# EAGLE design RTI-Dome-eth-RP2040 (EAGLE 9.6.2)

## Sheet 1 of 2
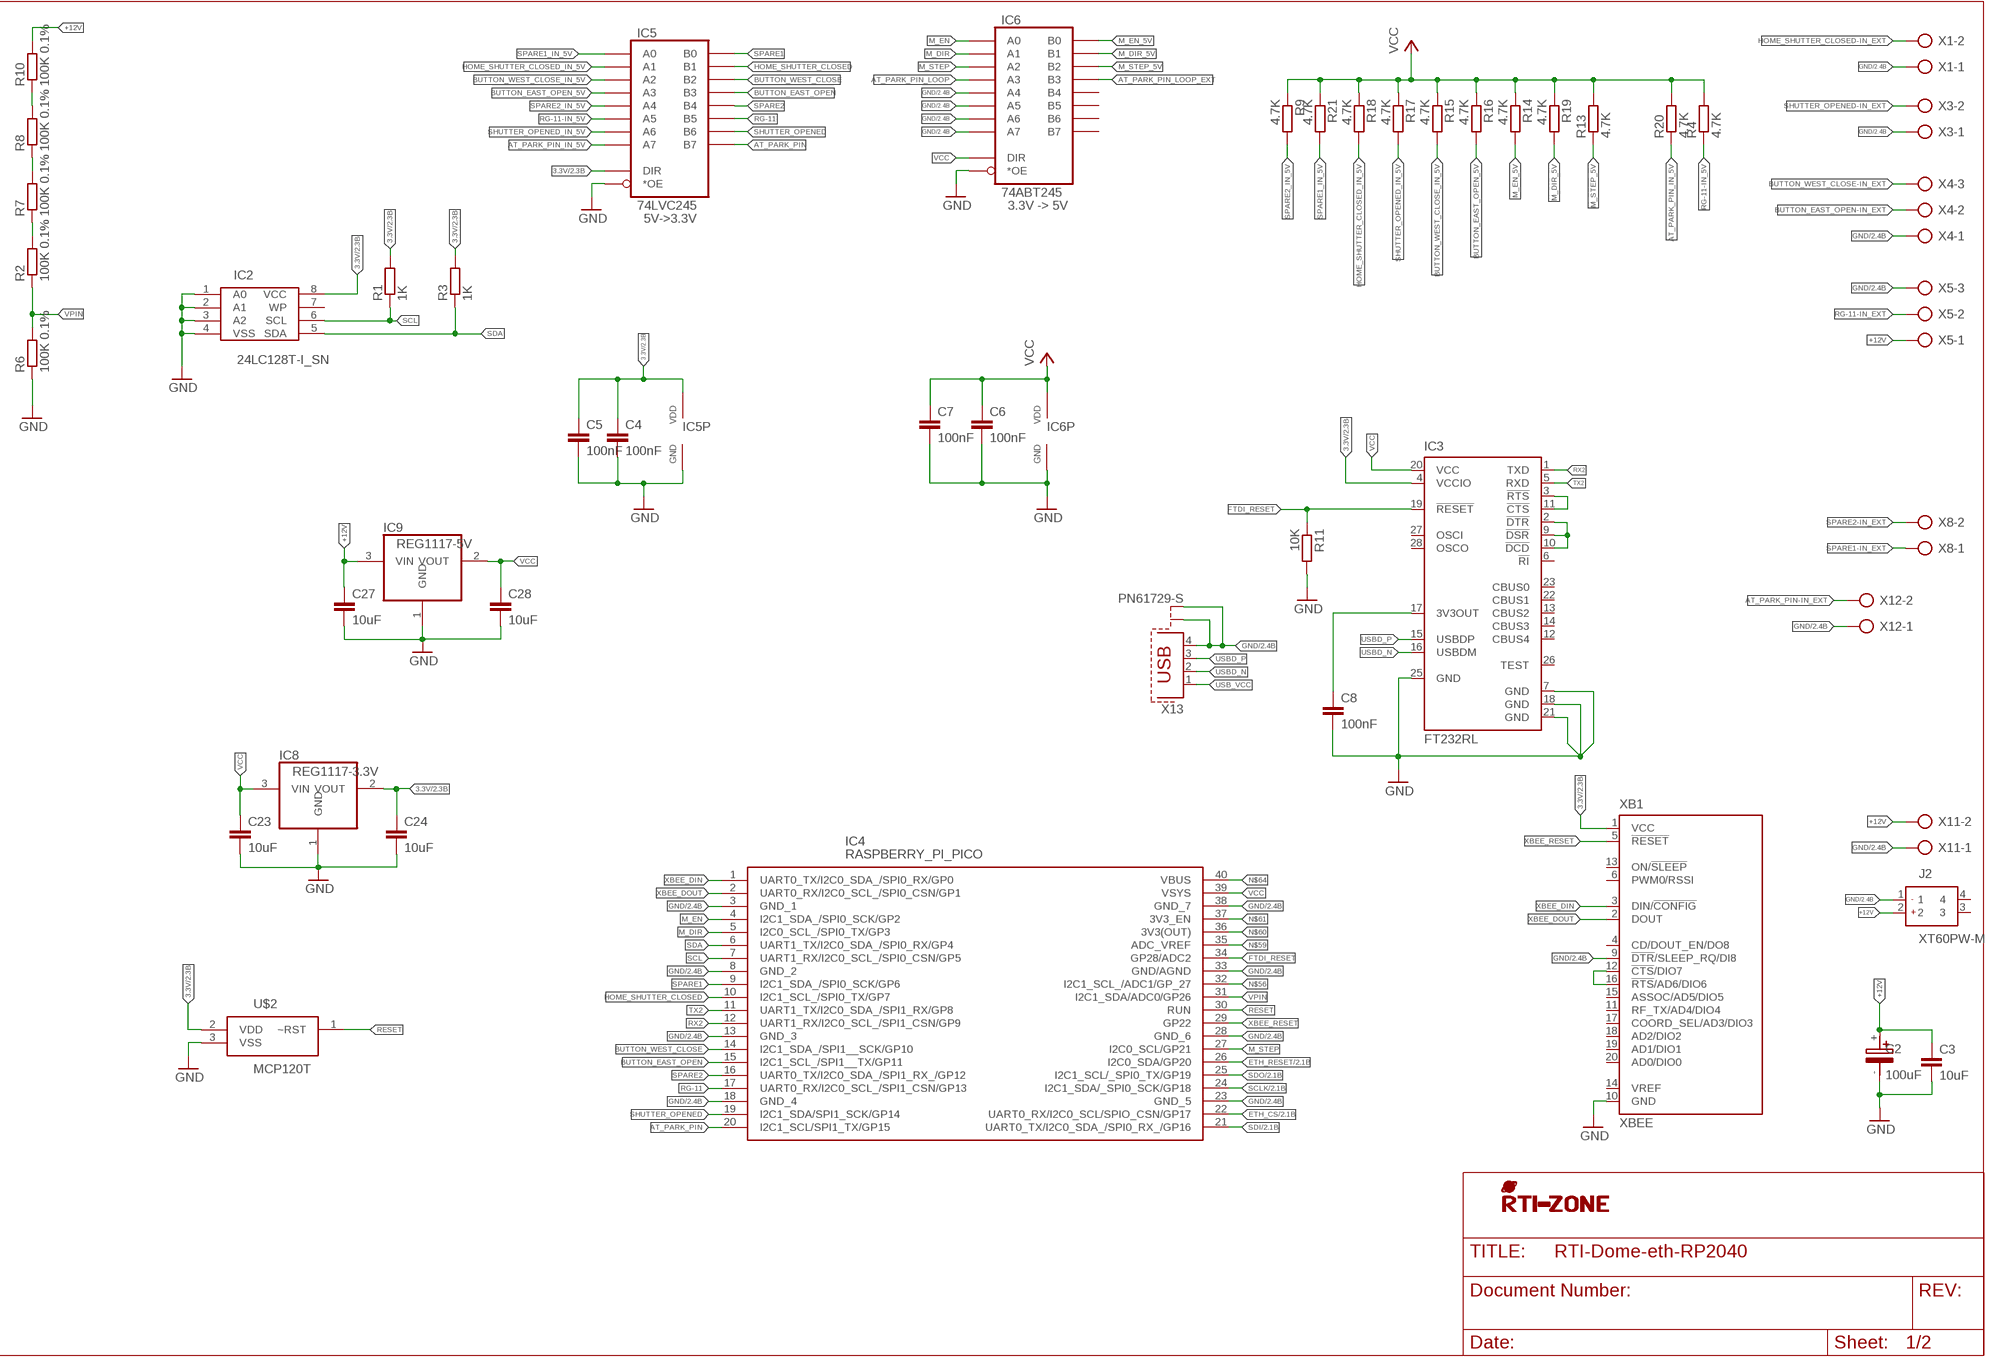
[diagram p0: schematic, sheet 1, part 1 of 2]
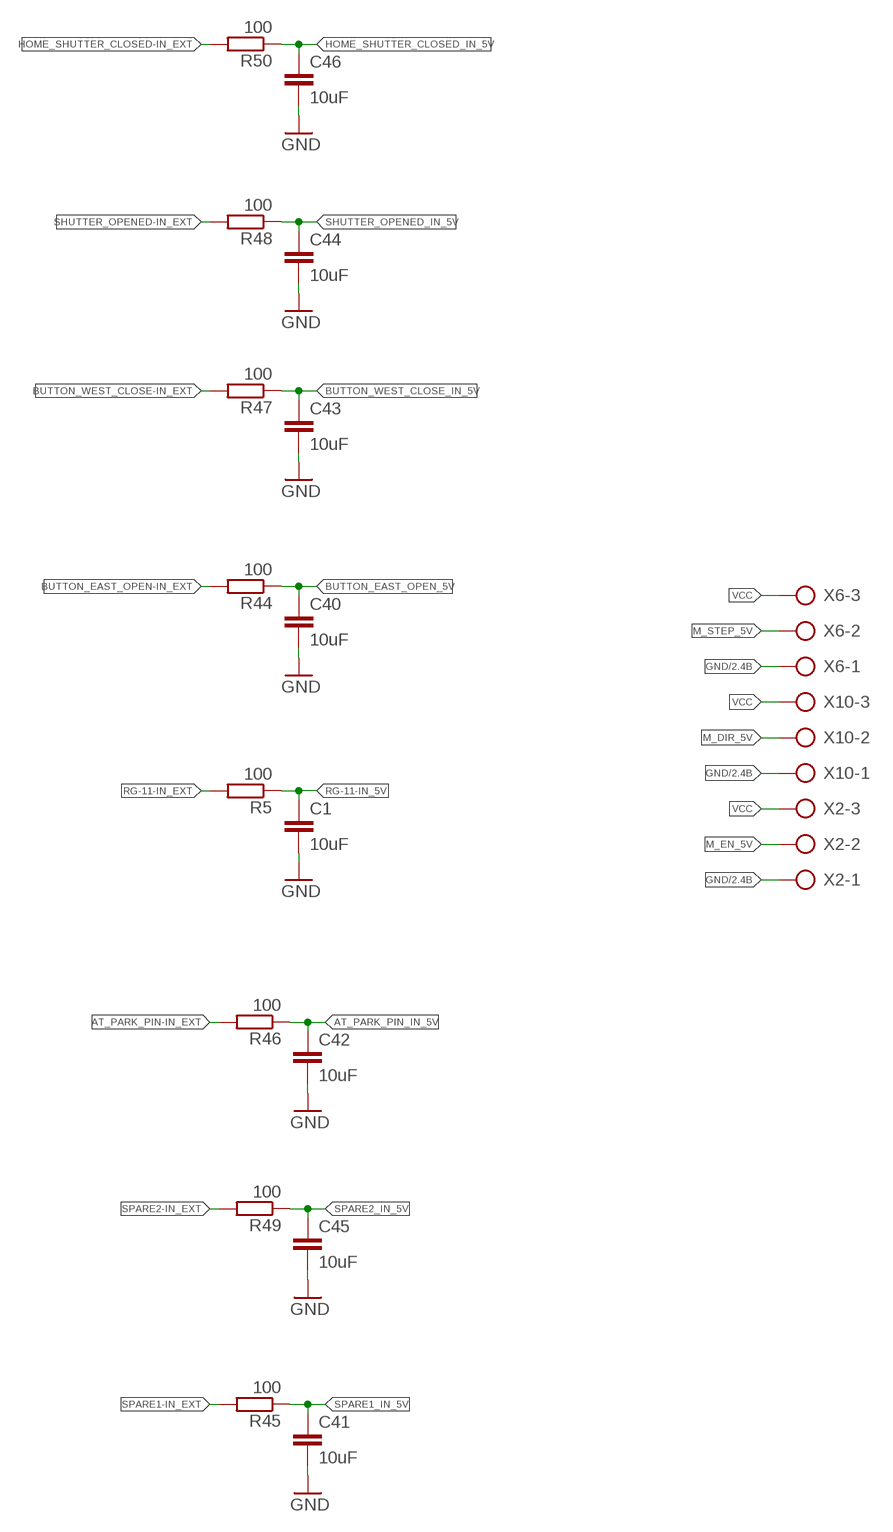
[diagram p1: schematic, sheet 1, part 2 of 2]

### Parts
C1  10uF  C-EUC0805  [C0805]
C2  100uF  MAL215099804E3""  [UD-10X10_NICHICON]
C3  10uF  C-EUC0805  [C0805]
C4  100nF  C-EUC0805  [C0805]
C5  100nF  C-EUC0805  [C0805]
C6  100nF  C-EUC0805  [C0805]
C7  100nF  C-EUC0805  [C0805]
C8  100nF  C-EUC0805  [C0805]
C23  10uF  C-EUC0805  [C0805]
C24  10uF  C-EUC0805  [C0805]
C27  10uF  C-EUC0805  [C0805]
C28  10uF  C-EUC0805  [C0805]
C40  10uF  C-EUC0805  [C0805]
C41  10uF  C-EUC0805  [C0805]
C42  10uF  C-EUC0805  [C0805]
C43  10uF  C-EUC0805  [C0805]
C44  10uF  C-EUC0805  [C0805]
C45  10uF  C-EUC0805  [C0805]
C46  10uF  C-EUC0805  [C0805]
IC2  24LC128T-I_SN  [SOIC127P600X175-8N]
IC3  FT232RL  [SSOP28]
IC4  RASPBERRY_PI_PICO  [RASPBERRYPIPICO]
IC5  74LVC245  [TSSOP20]
IC6  74ABT245  [TSSOP20]
IC8  REG1117-3.3V  REG1117  [SOT223]
IC9  REG1117-5V  REG1117  [SOT223]
J2  XT60PW-M  [XT60PWM]
R1  1K  R-EU_R0805  [R0805]
R2  100K 0.1%  R-EU_R0805  [R0805]
R3  1K  R-EU_R0805  [R0805]
R4  4.7K  R-EU_R0805  [R0805]
R5  100  R-EU_R0805  [R0805]
R6  100K 0.1%  R-EU_R0805  [R0805]
R7  100K 0.1%  R-EU_R0805  [R0805]
R8  100K 0.1%  R-EU_R0805  [R0805]
R9  4.7K  R-EU_R0805  [R0805]
R10  100K 0.1%  R-EU_R0805  [R0805]
R11  10K  R-EU_R0805  [R0805]
R13  4.7K  R-EU_R0805  [R0805]
R14  4.7K  R-EU_R0805  [R0805]
R15  4.7K  R-EU_R0805  [R0805]
R16  4.7K  R-EU_R0805  [R0805]
R17  4.7K  R-EU_R0805  [R0805]
R18  4.7K  R-EU_R0805  [R0805]
R19  4.7K  R-EU_R0805  [R0805]
R20  4.7K  R-EU_R0805  [R0805]
R21  4.7K  R-EU_R0805  [R0805]
R44  100  R-EU_R0805  [R0805]
R45  100  R-EU_R0805  [R0805]
R46  100  R-EU_R0805  [R0805]
R47  100  R-EU_R0805  [R0805]
R48  100  R-EU_R0805  [R0805]
R49  100  R-EU_R0805  [R0805]
R50  100  R-EU_R0805  [R0805]
U$2  MCP120T  [SOT95P237X112-3N]
U$4  RTI-LOGO_BIG  [LOGO_BIG]
X1  AK500/2  [AK500/2]
X2  AK500/3  [AK500/3]
X3  AK500/2  [AK500/2]
X4  AK500/3  [AK500/3]
X5  AK500/3  [AK500/3]
X6  AK500/3  [AK500/3]
X8  AK500/2  [AK500/2]
X10  AK500/3  [AK500/3]
X11  AK500/2  [AK500/2]
X12  AK500/2  [AK500/2]
X13  PN61729-S  [PN61729-S]
XB1  XBEE  [XBEE]

### Nets
3.3V: C4.1 C5.1 C24.1 IC2.8(VCC) IC3.4(VCCIO) IC5.P$1(DIR) IC5.P$20(VDD) IC8.2(VOUT) R1.2 R3.2 U$2.2(VDD) XB1.1(VCC) ; also sheet 2
+12V [+12V]: C2.+ C3.1 C27.1 IC9.3(VIN) J2.2 R10.2 X5.1 X11.2
AT_PARK_PIN: IC4.20(I2C1_SCL/SPI1_TX/GP15) IC5.P$11(B7)
AT_PARK_PIN-IN_EXT: R46.2 X12.2
AT_PARK_PIN_IN_5V: C42.1 IC5.P$9(A7) R20.1 R46.1
AT_PARK_PIN_LOOP: IC6.P$5(A3)
AT_PARK_PIN_LOOP_EXT: IC6.P$15(B3)
BUTTON_EAST_OPEN: IC4.15(I2C1_SCL_/SPI1__TX/GP11) IC5.P$15(B3)
BUTTON_EAST_OPEN-IN_EXT: R44.2 X4.2
BUTTON_EAST_OPEN_5V: C40.1 IC5.P$5(A3) R16.2 R44.1
BUTTON_WEST_CLOSE: IC4.14(I2C1_SDA_/SPI1__SCK/GP10) IC5.P$16(B2)
BUTTON_WEST_CLOSE-IN_EXT: R47.2 X4.3
BUTTON_WEST_CLOSE_IN_5V: C43.1 IC5.P$4(A2) R15.2 R47.1
DTR_DSR_DCD: IC3.2(!DTR) IC3.9(!DSR) IC3.10(!DCD)
ETH_CS: IC4.22(UART0_RX/I2C0_SCL/SPIO_CSN/GP17) ; also sheet 2
ETH_RESET: IC4.26(I2C0_SDA/GP20) ; also sheet 2
FTDI_RESET: IC3.19(!RESET) IC4.34(GP28/ADC2) R11.1
GND [GND]: C1.2 C2.- C3.2 C4.2 C5.2 C6.2 C7.2 C8.2 C23.2 C24.2 C27.2 C28.2 C40.2 C41.2 C42.2 C43.2 C44.2 C45.2 C46.2 IC2.1(A0) IC2.2(A1) IC2.3(A2) IC2.4(VSS) IC3.7(GND) IC3.18(GND) IC3.21(GND) IC3.25(GND) IC4.3(GND_1) IC4.8(GND_2) IC4.13(GND_3) IC4.18(GND_4) IC4.23(GND_5) IC4.28(GND_6) IC4.33(GND/AGND) IC4.38(GND_7) IC5.P$10(GND) IC5.P$19(*OE) IC6.P$6(A4) IC6.P$7(A5) IC6.P$8(A6) IC6.P$9(A7) IC6.P$10(GND) IC6.P$19(*OE) IC8.1(GND) IC9.1(GND) J2.1 R6.1 R11.2 U$2.3(VSS) X1.1 X2.1 X3.1 X4.1 X5.3 X6.1 X10.1 X11.1 X12.1 X13.4 X13.S1 X13.S2 XB1.9(!DTR!/SLEEP_RQ/DI8) XB1.10(GND) ; also sheet 2
HOME_SHUTTER_CLOSED: IC4.10(I2C1_SCL_/SPI0_TX/GP7) IC5.P$17(B1)
HOME_SHUTTER_CLOSED-IN_EXT: R50.2 X1.2
HOME_SHUTTER_CLOSED_IN_5V: C46.1 IC5.P$3(A1) R18.2 R50.1
M_DIR: IC4.5(I2C0_SCL_/SPI0_TX/GP3) IC6.P$3(A1)
M_DIR_5V: IC6.P$17(B1) R19.2 X10.2
M_EN: IC4.4(I2C1_SDA_/SPI0_SCK/GP2) IC6.P$2(A0)
M_EN_5V: IC6.P$18(B0) R14.2 X2.2
M_STEP: IC4.27(I2C0_SCL/GP21) IC6.P$4(A2)
M_STEP_5V: IC6.P$16(B2) R13.1 X6.2
N$2: R7.2 R8.1
N$3: R8.2 R10.1
N$5: R2.2 R7.1
N$6: C8.1 IC3.17(3V3OUT)
N$9: XB1.12(!CTS!/DIO7) XB1.16(!RTS!/AD6/DIO6)
N$56: IC4.32(I2C1_SCL_/ADC1/GP_27)
N$59: IC4.35(ADC_VREF)
N$60: IC4.36(3V3(OUT))
N$61: IC4.37(3V3_EN)
N$64: IC4.40(VBUS)
RESET: IC4.30(RUN) U$2.1(~RST)
RG-11: IC4.17(UART0_RX/I2C0_SCL_/SPI1_CSN/GP13) IC5.P$13(B5)
RG-11-IN_5V: C1.1 IC5.P$7(A5) R4.1 R5.1
RG-11-IN_EXT: R5.2 X5.2
RTS_CTS: IC3.3(!RTS) IC3.11(!CTS)
RX2: IC3.1(TXD) IC4.12(UART1_RX/I2C0_SCL_/SPI1_CSN/GP9)
SCL: IC2.6(SCL) IC4.7(UART1_RX/I2C0_SCL_/SPI0_CSN/GP5) R1.1
SCLK: IC4.24(I2C1_SDA/_SPI0_SCK/GP18) ; also sheet 2
SDA: IC2.5(SDA) IC4.6(UART1_TX/I2C0_SDA_/SPI0_RX/GP4) R3.1
SDI: IC4.21(UART0_TX/I2C0_SDA_/SPI0_RX_/GP16) ; also sheet 2
SDO: IC4.25(I2C1_SCL/_SPI0_TX/GP19) ; also sheet 2
SHUTTER_OPENED: IC4.19(I2C1_SDA/SPI1_SCK/GP14) IC5.P$12(B6)
SHUTTER_OPENED-IN_EXT: R48.2 X3.2
SHUTTER_OPENED_IN_5V: C44.1 IC5.P$8(A6) R17.2 R48.1
SPARE1: IC4.9(I2C1_SDA_/SPI0_SCK/GP6) IC5.P$18(B0)
SPARE1-IN_EXT: R45.2 X8.1
SPARE1_IN_5V: C41.1 IC5.P$2(A0) R21.2 R45.1
SPARE2: IC4.16(UART0_TX/I2C0_SDA_/SPI1_RX_/GP12) IC5.P$14(B4)
SPARE2-IN_EXT [GND]: R49.2 X8.2
SPARE2_IN_5V [GND]: C45.1 IC5.P$6(A4) R9.2 R49.1
TX2: IC3.5(RXD) IC4.11(UART1_TX/I2C0_SDA_/SPI1_RX/GP8)
USB_VCC: X13.1
USBD_N: IC3.16(USBDM) X13.2
USBD_P: IC3.15(USBDP) X13.3
VCC: C6.1 C7.1 C23.1 C28.1 IC3.20(VCC) IC4.39(VSYS) IC6.P$1(DIR) IC6.P$20(VDD) IC8.3(VIN) IC9.2(VOUT) R4.2 R9.1 R13.2 R14.1 R15.1 R16.1 R17.1 R18.1 R19.1 R20.2 R21.1 X2.3 X6.3 X10.3
VPIN: IC4.31(I2C1_SDA/ADC0/GP26) R2.1 R6.2
XBEE_DIN: IC4.1(UART0_TX/I2C0_SDA_/SPI0_RX/GP0) XB1.3(DIN/!CONFIG)
XBEE_DOUT: IC4.2(UART0_RX/I2C0_SCL_/SPI0_CSN/GP1) XB1.2(DOUT)
XBEE_RESET: IC4.29(GP22) XB1.5(!RESET)
Unconnected: IC2.7(WP) IC3.6(!RI) IC3.12(CBUS4) IC3.13(CBUS2) IC3.14(CBUS3) IC3.22(CBUS1) IC3.23(CBUS0) IC3.26(TEST) IC3.27(OSCI) IC3.28(OSCO) IC6.P$11(B7) IC6.P$12(B6) IC6.P$13(B5) IC6.P$14(B4) J2.3 J2.4 XB1.4(CD/DOUT_EN/DO8) XB1.6(PWM0/RSSI) XB1.11(RF_TX/AD4/DIO4) XB1.13(ON/!SLEEP) XB1.14(VREF) XB1.15(ASSOC/AD5/DIO5) XB1.17(COORD_SEL/AD3/DIO3) XB1.18(AD2/DIO2) XB1.19(AD1/DIO1) XB1.20(AD0/DIO0)

### Notes on the sheet
- 3.3V -> 5V
- 5V->3.3V

## Sheet 2 of 2
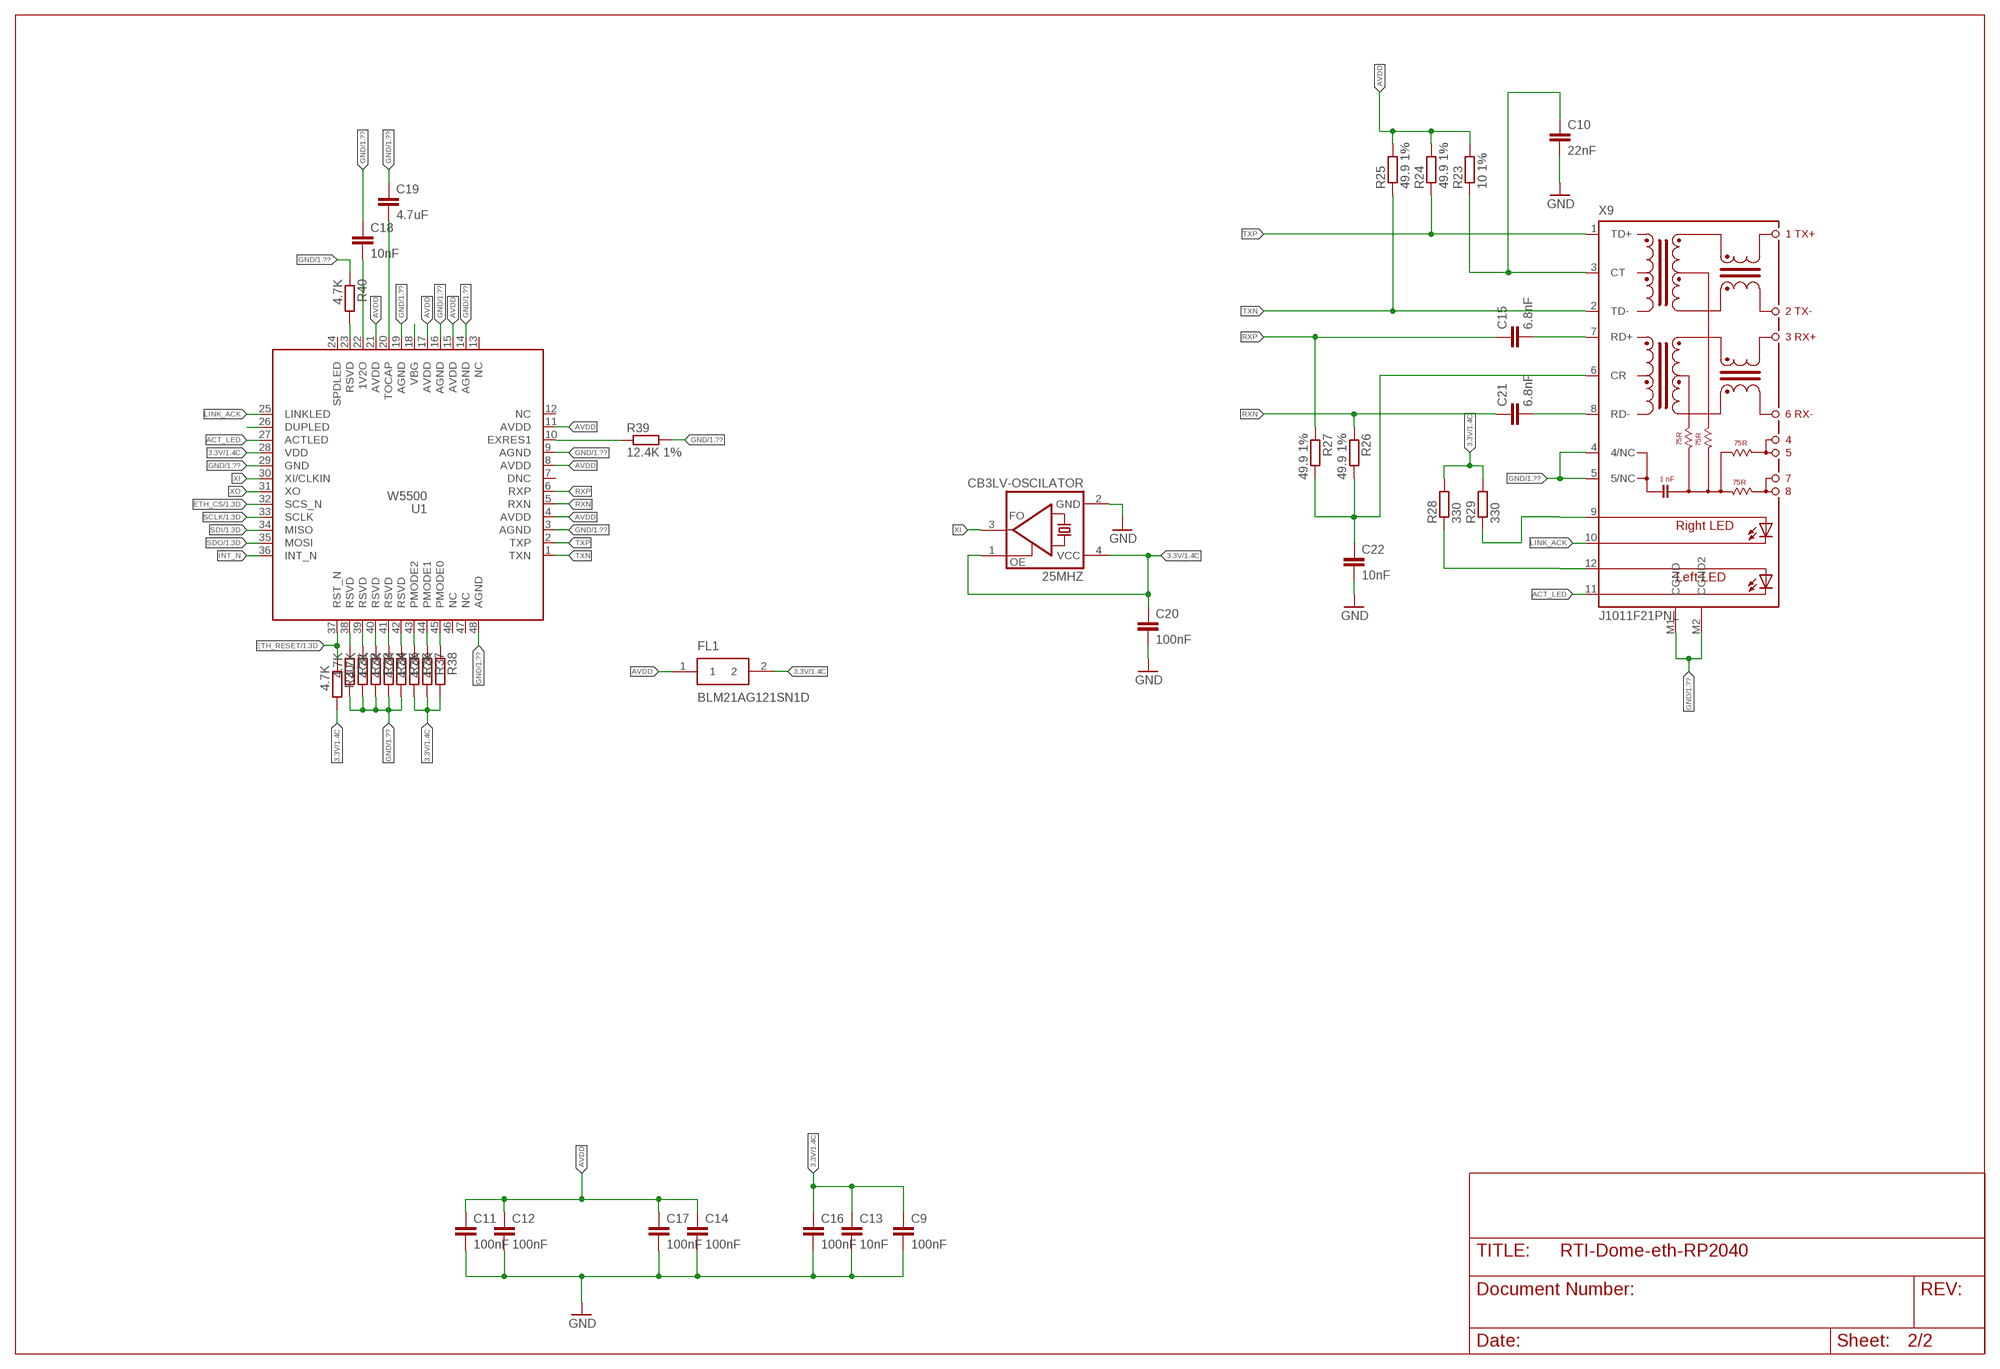
[diagram p2: schematic, sheet 2]

### Parts
25MHZ  CB3LV-OSCILATOR  [SMD-7050_4P]
C9  100nF  C-EUC0805  [C0805]
C10  22nF  C-EUC0805  [C0805]
C11  100nF  C-EUC0805  [C0805]
C12  100nF  C-EUC0805  [C0805]
C13  10nF  C-EUC0805  [C0805]
C14  100nF  C-EUC0805  [C0805]
C15  6.8nF  C-EUC0805  [C0805]
C16  100nF  C-EUC0805  [C0805]
C17  100nF  C-EUC0805  [C0805]
C18  10nF  C-EUC0805  [C0805]
C19  4.7uF  C-EUC0805  [C0805]
C20  100nF  C-EUC0805  [C0805]
C21  6.8nF  C-EUC0805  [C0805]
C22  10nF  C-EUC0805  [C0805]
FL1  BLM21AG121SN1D  [L0805]
R23  10 1%  R-EU_R0805  [R0805]
R24  49.9 1%  R-EU_R0805  [R0805]
R25  49.9 1%  R-EU_R0805  [R0805]
R26  49.9 1%  R-EU_R0805  [R0805]
R27  49.9 1%  R-EU_R0805  [R0805]
R28  330  R-EU_R0805  [R0805]
R29  330  R-EU_R0805  [R0805]
R30  4.7K  R-EU_R0805  [R0805]
R31  4.7K  R-EU_R0805  [R0805]
R32  4.7K  R-EU_R0805  [R0805]
R33  4.7K  R-EU_R0805  [R0805]
R34  4.7K  R-EU_R0805  [R0805]
R35  4.7K  R-EU_R0805  [R0805]
R36  4.7K  R-EU_R0805  [R0805]
R37  4.7K  R-EU_R0805  [R0805]
R38  4.7K  R-EU_R0805  [R0805]
R39  12.4K 1%  R-EU_R0805  [R0805]
R40  4.7K  R-EU_R0805  [R0805]
U1  W5500  [LQFP48]
X9  J1011F21PNL  [J1011F21PNL]

### Nets
3.3V: 25MHZ.1(OE) 25MHZ.4(VDD) C9.1 C13.1 C16.1 C20.1 FL1.2 R28.2 R29.2 R30.2 R36.2 R37.2 R38.2 U1.28(VDD) ; also sheet 1
ACT_LED: U1.27(ACTLED) X9.11(C-L)
AVDD: C11.1 C12.1 C14.1 C17.1 FL1.1 R23.2 R24.2 R25.2 U1.4(AVDD) U1.8(AVDD) U1.11(AVDD) U1.15(AVDD) U1.17(AVDD) U1.21(AVDD)
ETH_CS: U1.32(SCS_N) ; also sheet 1
ETH_RESET: R30.1 U1.37(RST_N) ; also sheet 1
GND [GND]: 25MHZ.2(GND) C9.2 C10.2 C11.2 C12.2 C13.2 C14.2 C16.2 C17.2 C18.1 C19.1 C20.2 C22.2 R31.2 R32.2 R33.2 R34.2 R35.2 R39.2 R40.1 U1.3(AGND) U1.9(AGND) U1.14(AGND) U1.16(AGND) U1.19(AGND) U1.29(GND) U1.48(AGND) X9.4(4/NC) X9.5(5/NC) X9.M1(CGND) X9.M2(CGND2) ; also sheet 1
INT_N: U1.36(INT_N)
LINK_ACK: U1.25(LINKLED) X9.10(C-R)
N$7 [+3V3]: C22.1 R26.2 R27.2 X9.6(CR)
N$8: R29.1 X9.9(A-R)
N$10: R28.1 X9.12(AL)
N$11: C15.2 X9.7(RD+)
N$12: C21.2 X9.8(RD-)
N$13 [+3V3]: C10.1 R23.1 X9.3(CT)
N$17: U1.26(DUPLED)
N$22: R31.1 U1.38(RSVD)
N$23: R32.1 U1.39(RSVD)
N$24: R33.1 U1.40(RSVD)
N$25: R34.1 U1.41(RSVD)
N$26: R35.1 U1.42(RSVD)
N$27: R36.1 U1.43(PMODE2)
N$28: R37.1 U1.44(PMODE1)
N$29: R38.1 U1.45(PMODE0)
N$31: C19.2 U1.20(TOCAP)
N$32: U1.18(VBG)
N$33: C18.2 U1.22(1V2O)
N$34: R39.1 U1.10(EXRES1)
N$35: R40.2 U1.23(RSVD)
RXN: C21.1 R26.1 U1.5(RXN)
RXP: C15.1 R27.1 U1.6(RXP)
SCLK: U1.33(SCLK) ; also sheet 1
SDI: U1.34(MISO) ; also sheet 1
SDO: U1.35(MOSI) ; also sheet 1
TXN [diff]: R25.1 U1.1(TXN) X9.2(TD-)
TXP: R24.1 U1.2(TXP) X9.1(TD+)
XI: 25MHZ.3(FO) U1.30(XI/CLKIN)
XO: U1.31(XO)
Unconnected: U1.7(DNC) U1.12(NC) U1.13(NC) U1.24(SPDLED) U1.46(NC) U1.47(NC)

## Library data of the parts
25MHZ = rti:CB3LV-OSCILATOR; MPN: CB3LV-3I-25M0000
C1 C3 C23 C24 C27 C28 C40-C46 = rcl:C-EU: CAPACITOR, European symbol; MPN: CC0805KKX5R8BB106; SPICEPREFIX: C
C2 = samacsys:MAL215099804E3: Aluminum Electrolytic Capacitors - SMD 100uF 63V 20% Source: Datasheet <https://www.vishay.com/docs/28395/150crz.pdf>; MPN: MAL215099804E3
C4-C9 C11 C12 C14 C16 C17 C20 = rcl:C-EU: CAPACITOR, European symbol; MPN: 0805YD104KAT2A; SPICEPREFIX: C
C10 = rcl:C-EU: CAPACITOR, European symbol; MPN: CC0805JRX7R8BB223; SPICEPREFIX: C
C13 C18 C22 = rcl:C-EU: CAPACITOR, European symbol; MPN: CC0805KRX7R9BB103; SPICEPREFIX: C
C15 C21 = rcl:C-EU: CAPACITOR, European symbol; MPN: C0805C682F4HACTU; SPICEPREFIX: C
C19 = rcl:C-EU: CAPACITOR, European symbol; MPN: C0805C475J3RACTU; SPICEPREFIX: C
FL1 = BLM21AG121SN1D:BLM21AG121SN1D: BLM21_N1D Series EMI Suppression Filter 120+/-25% at 100MHz 1A @85 Source: Datasheet <https://www.murata.com/en-us/products/productdetail?partno=BLM21AG121SN1#>; MPN: BLM21AG121SN1D
IC2 = rti:24LC128T-I_SN: 128K I2C CMOS Serial EEPROM Source: Datasheet <http://componentsearchengine.com/Datasheets/3/24LC128T-I_SN.pdf>; ARROW_PART_NUMBER: 24LC128T-I/SN; ARROW_PRICE-STOCK: https://www.arrow.com/en/products/24lc128t-isn/microchip-technology?region=nac; DESCRIPTION: 128K I2C CMOS Serial EEPROM; HEIGHT: 1.75mm; MANUFACTURER_NAME: Microchip; MANUFACTURER_PART_NUMBER: 24LC128T-I/SN; MOUSER_PART_NUMBER: 579-24LC128T-I/SN; MOUSER_PRICE-STOCK: https://www.mouser.co.uk/ProductDetail/Microchip-Technology-Atmel/24LC128T-I-SN?qs=gySgac5WNsG75YWNtruaXg%3D%3D
IC3 = ftdichip:FT232R: Source: http://www.ftdichip.com/Documents/DataSheets/DS_FT232R_v104.pdf; MPN: FT232RL-REEL; OC_FARNELL: 1146032; OC_NEWARK: 91K9918
IC4 = samacsys:RASPBERRY_PI_PICO: RASPBERRY-PI - RASPBERRY PI PICO W - Raspberry Pi Board, Raspberry Pi Pico W, RP2040, 32bit, ARM Cortex-M0+ Source: Datasheet <https://datasheets.raspberrypi.com/picow/pico-w-datasheet.pdf>; DESCRIPTION: RASPBERRY-PI - RASPBERRY PI PICO - Raspberry Pi Board, Raspberry Pi Pic, RP2040, 32bit, ARM Cortex-M0+; HEIGHT: 1mm; MANUFACTURER_NAME: RASPBERRY-PI PICO; MANUFACTURER_PART_NUMBER: SC0916; MOUSER_PART_NUMBER: SC0915; MPN: SC0916
IC5 = rti:74*245; MPN: SN74LVC245APWR
IC6 = rti:74*245; MPN: 74ABT245PW,118
IC8 IC9 = burr-brown:REG1117: 800mA and 1A Low Dropout (LDO) Positive Regulator 1.8V, 2.5V, 2.85V, 3.3V, 5V, and Adj; MPN: REG1117-3.3/2K5; OC_FARNELL: 1097566; OC_NEWARK: 14P6981
J2 = samacsys:XT60PW-M: Socket; DC supply; XT60; male; PIN: 2; on PCBs; THT; Colour: yellow Source: Datasheet <https://www.tme.eu/Document/9b8d0c5eb7094295f3d3112c214d3ade/XT60PW SPEC.pdf>; DESCRIPTION: Socket; DC supply; XT60; male; PIN: 2; on PCBs; THT; Colour: yellow; HEIGHT: 8.4mm; MANUFACTURER_NAME: Changzou Amass Elec; MANUFACTURER_PART_NUMBER: XT60PW-M
R1 R3 = rcl:R-EU_: RESISTOR, European symbol; MPN: RT0805FRE071KL; SPICEPREFIX: R
R2 R6-R8 R10 = rcl:R-EU_: RESISTOR, European symbol; MPN: AT0805BRD07100KL; SPICEPREFIX: R
R4 R9 R13-R21 R30-R38 R40 = rcl:R-EU_: RESISTOR, European symbol; MPN: RT0805FRE074K7L; SPICEPREFIX: R
R5 R44-R50 = rcl:R-EU_: RESISTOR, European symbol; MPN: RT0805FRD07100RL; SPICEPREFIX: R
R11 = rcl:R-EU_: RESISTOR, European symbol; MPN: RT0805FRE0710KL; SPICEPREFIX: R
R23 = rcl:R-EU_: RESISTOR, European symbol; MPN: RT0805FRE1310RL; SPICEPREFIX: R
R24-R27 = rcl:R-EU_: RESISTOR, European symbol; MPN: RC0805FR-0749R9L; SPICEPREFIX: R
R28 R29 = rcl:R-EU_: RESISTOR, European symbol; MPN: RC0805JR-07330RL; SPICEPREFIX: R
R39 = rcl:R-EU_: RESISTOR, European symbol; MPN: RC0805FR-0712K4L; SPICEPREFIX: R
U1 = W5500:W5500; MPN: W5500
U$2 = MCP120T:MCP120T: Microcontroller Supervisory Circuit Source: Datasheet; DESCRIPTION: Microcontroller Supervisory Circuit; HEIGHT: mm; MANUFACTURER_NAME: Microchip; MANUFACTURER_PART_NUMBER: MCP120T-315I/TT; MOUSER_PART_NUMBER: 579-MCP120T-315I/TT; MOUSER_PRICE-STOCK: https://www.mouser.com/ProductDetail/Microchip-Technology/MCP120T-315I-TT/?qs=6pREnGtJ7gEI3DoW5cf%2FYQ%3D%3D; MPN: MCP120T-270I/TT
U$4 = rti:RTI-LOGO
X1 X3 X8 X11 X12 = rti:AK500/2: CONNECTOR; MPN: 691101710002; OC_FARNELL: unknown; OC_NEWARK: unknown
X2 X6 X10 = rti:AK500/3: CONNECTOR; OC_FARNELL: unknown; OC_NEWARK: unknown
X4 X5 = rti:AK500/3: CONNECTOR; MPN: 691101710003; OC_FARNELL: unknown; OC_NEWARK: unknown
X9 = rti:J1011F: PULSEJACK (TM) 1x1 Tab-UP RJ45 10/100 Base-TX RJ45 1x1 Tab-UP with LEDs 8-pin (J1 series) and 6-pin (JP series) integrated magnetics connector, designed to support applications, such as ADSL modems, LAN-on-Motherboard, and Hub and Switches. Source: www.pulseeng.com .. PulseJack-J402.pdf; MPN: J1011F21PNL
X13 = rti:PN61729-S: BERG USB connector; MPN: SS-52300-001; OC_FARNELL: unknown; OC_NEWARK: unknown
XB1 = rti:XBEE: XBee (TM) /XBee-PRO(TM) OEM RF Modules Source: MaxStream, Inc. xbee_productmanual.pdf; MPN: XBP24-Z7UIT-004; OC_FARNELL: 1751799; OC_NEWARK: 34R5507

## Net classes
0 default: width 0.254 mm, drill 0.3 mm, clearance 0.152 mm
1 +12V: width 0.254 mm, drill 0.3 mm, clearance 0.152 mm
2 GND: width 0.254 mm, drill 0.3 mm, clearance 0.152 mm
3 +3V3: width 0.254 mm, drill 0.254 mm, clearance 0.152 mm
4 diff: width 0.254 mm, drill 0.254 mm, clearance 0.152 mm

## Board
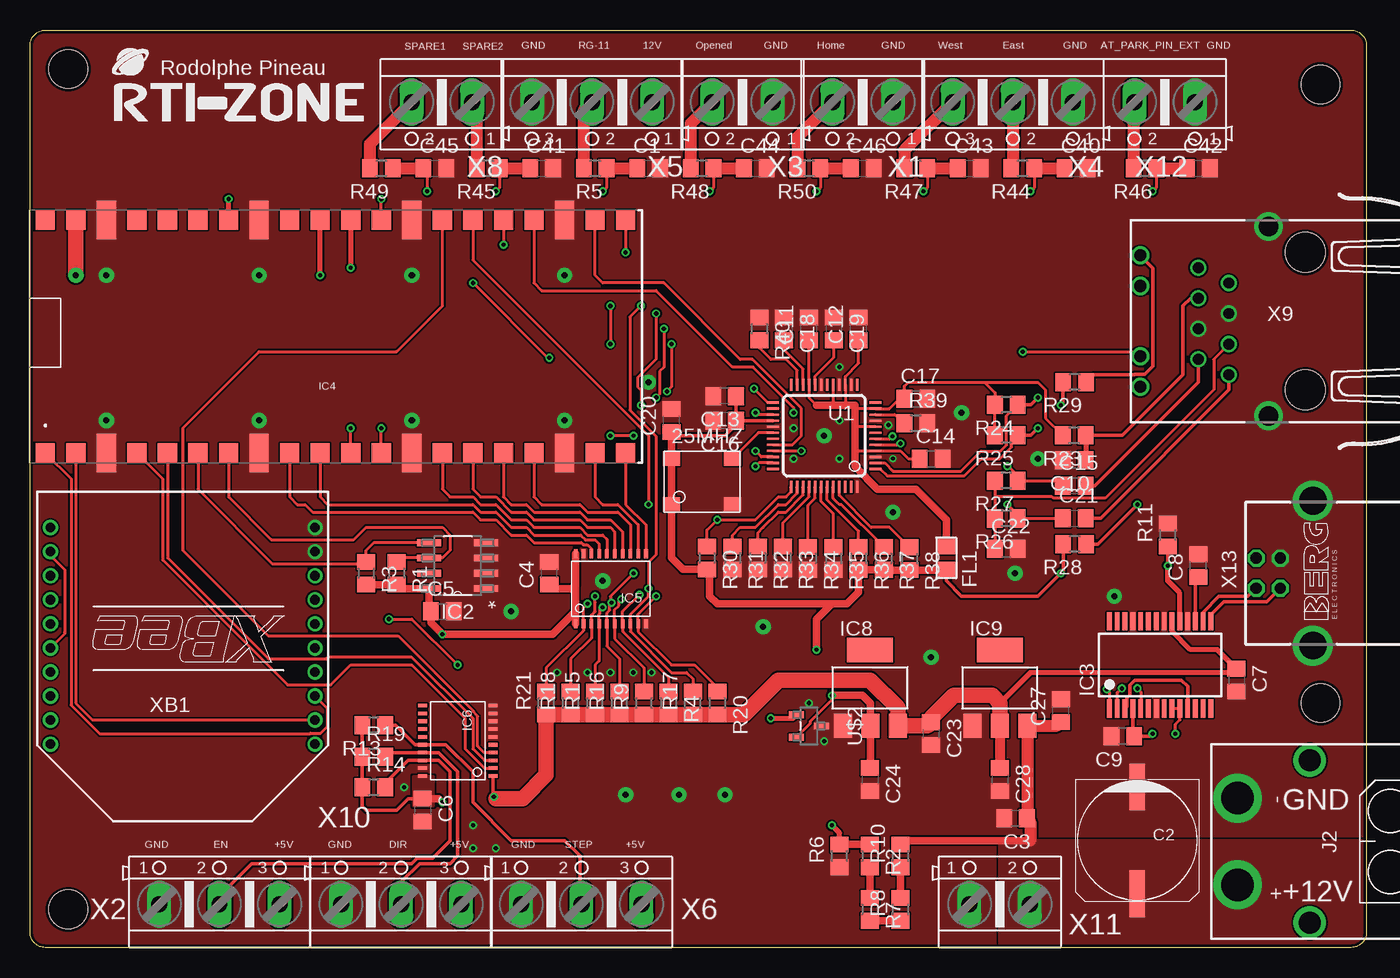
[diagram p3: board, top side]
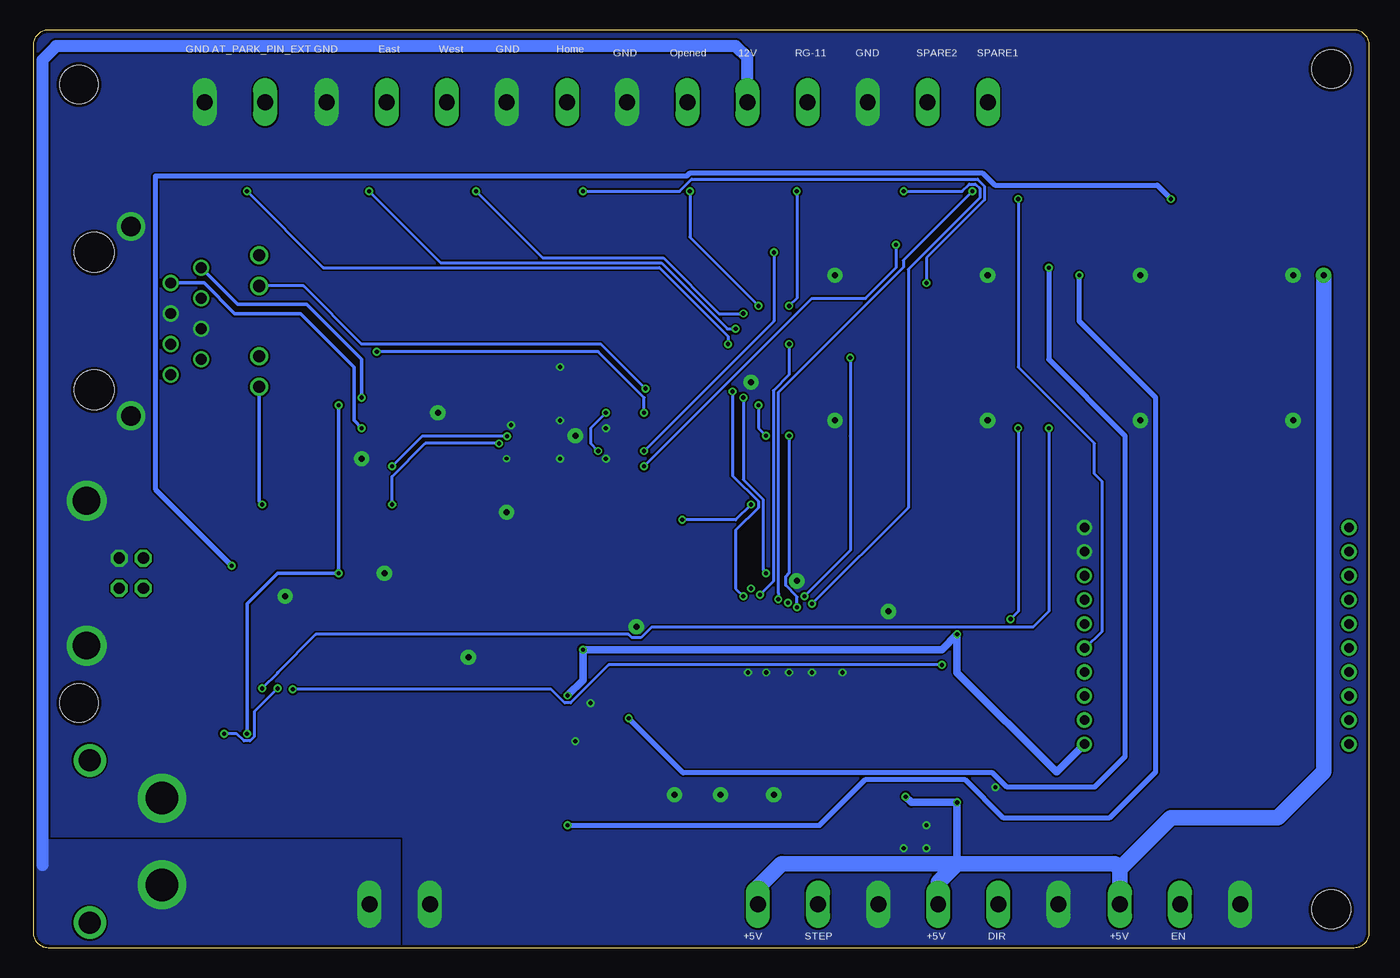
[diagram p4: board, bottom side, seen from below]

Size 111.13 x 76.27 mm. Coordinates in mm from the lower left corner, seen from the top.
Outline: 0,75.01 arc-90 1.26,76.27 109.87,76.27 arc-90 111.13,75.01 111.13,1.26 arc-90 109.87,0 1.26,0 arc-90 0,1.26 0,75.01
Copper layers (1*16): Top 0.089mm / dielectric 1.442mm / Bottom 0.089mm
Design rules "jlcpcb2layer *": minimum track width 5mil, minimum drill 0.2mm, track to track 5mil, track to pad 5mil, pad to pad 5mil, via to via 5mil, smd to smd 5mil, copper to edge 10mil, drill to drill 0.5mm, minimum pad ring 6mil, minimum via ring 6mil, stop-mask expansion 0.05mm, vias tented up to drill 130mil, thermal gap 8mil
Holes 3.2 mm at 107.31,71.75 107.31,20.32 3.17,3.17 3.17,73.03

### Footprints (pad centres in the part's own frame; a part is rotated, then mirrored left to right if it is on the bottom)
SMD-7050_4P = smd 1.397 x 1.194: 1 -2.54,-1.27; 2 2.54,-1.27; 3 2.54,2.54; 4 -2.54,2.54
C0805 = smd 1.3 x 1.5: 1 -0.95,0; 2 0.95,0
UD-10X10_NICHICON = smd 3.9 x 1.3: + 4.433,0; - -4.458,0
L0805 = smd 1.3 x 1.5: 1 -0.95,0; 2 0.95,0
SOIC127P600X175-8N = smd 1.981 x 0.559: 1 -2.362,1.905; 2 -2.362,0.635; 3 -2.362,-0.635; 4 -2.362,-1.905; 5 2.362,-1.905; 6 2.362,-0.635; 7 2.362,0.635; 8 2.362,1.905
SSOP28 = smd 0.4 x 1.5: 1 -4.225,-3.625; 2 -3.575,-3.625; 3 -2.925,-3.625; 4 -2.275,-3.625; 5 -1.625,-3.625; 6 -0.975,-3.625; 7 -0.325,-3.625; 8 0.325,-3.625; 9 0.975,-3.625; 10 1.625,-3.625; 11 2.275,-3.625; 12 2.925,-3.625; 13 3.575,-3.625; 14 4.225,-3.625; 15 4.225,3.625; 16 3.575,3.625; 17 2.925,3.625; 18 2.275,3.625; 19 1.625,3.625; 20 0.975,3.625; 21 0.325,3.625; 22 -0.325,3.625; 23 -0.975,3.625; 24 -1.625,3.625; 25 -2.275,3.625; 26 -2.925,3.625; 27 -3.575,3.625; 28 -4.225,3.625
RASPBERRYPIPICO = smd 1.6 x 1.6: 1 -9.69,24.13; 2 -9.69,21.59; 4 -9.69,16.51; 5 -9.69,13.97; 6 -9.69,11.43; 7 -9.69,8.89; 9 -9.69,3.81; 10 -9.69,1.27; 11 -9.69,-1.27; 12 -9.69,-3.81; 14 -9.69,-8.89; 15 -9.69,-11.43; 16 -9.69,-13.97; 17 -9.69,-16.51; 19 -9.69,-21.59; 20 -9.69,-24.13; 21 9.69,-24.13; 22 9.69,-21.59; 24 9.69,-16.51; 25 9.69,-13.97; 26 9.69,-11.43; 27 9.69,-8.89; 29 9.69,-3.81; 30 9.69,-1.27; 31 9.69,1.27; 32 9.69,3.81; 34 9.69,8.89; 35 9.69,11.43; 36 9.69,13.97; 37 9.69,16.51; 39 9.69,21.59; 40 9.69,24.13 | smd 3.2 x 1.6: 3 -9.69,19.05; 8 -9.69,6.35; 13 -9.69,-6.35; 18 -9.69,-19.05; 23 9.69,-19.05; 28 9.69,-6.35; 33 9.69,6.35; 38 9.69,19.05
TSSOP20 = smd 0.75 x 0.3: P$1 -2.94,2.885; P$2 -2.94,2.235; P$3 -2.94,1.585; P$4 -2.94,0.935; P$5 -2.94,0.285; P$6 -2.94,-0.365; P$7 -2.94,-1.015; P$8 -2.94,-1.665; P$9 -2.94,-2.315; P$10 -2.94,-2.965; P$11 2.91,-2.965; P$12 2.91,-2.315; P$13 2.91,-1.665; P$14 2.91,-1.015; P$15 2.91,-0.365; P$16 2.91,0.285; P$17 2.91,0.935; P$18 2.91,1.585; P$19 2.91,2.235; P$20 2.91,2.885
SOT223 = smd 1.499 x 2.007: 1 -2.261,-3.15; 2 0.025,-3.15; 3 2.311,-3.15 | smd 3.81 x 2.007: 4 0,3.15
XT60PWM = drill 2.7 pad 4.05: 1 -3.6,0; 2 3.6,0 | drill 1.8 pad 2.7: 3 6.75,6; 4 -6.75,6
R0805 = smd 1.3 x 1.5: 1 -0.95,0; 2 0.95,0
LQFP48 = smd 1 x 0.2: 1 -4.25,2.75; 2 -4.25,2.25; 3 -4.25,1.75; 4 -4.25,1.25; 5 -4.25,0.75; 6 -4.25,0.25; 7 -4.25,-0.25; 8 -4.25,-0.75; 9 -4.25,-1.25; 10 -4.25,-1.75; 11 -4.25,-2.25; 12 -4.25,-2.75; 25 4.25,-2.75; 26 4.25,-2.25; 27 4.25,-1.75; 28 4.25,-1.25; 29 4.25,-0.75; 30 4.25,-0.25; 31 4.25,0.25; 32 4.25,0.75; 33 4.25,1.25; 34 4.25,1.75; 35 4.25,2.25; 36 4.25,2.75 | smd 0.2 x 1: 13 -2.75,-4.25; 14 -2.25,-4.25; 15 -1.75,-4.25; 16 -1.25,-4.25; 17 -0.75,-4.25; 18 -0.25,-4.25; 19 0.25,-4.25; 20 0.75,-4.25; 21 1.25,-4.25; 22 1.75,-4.25; 23 2.25,-4.25; 24 2.75,-4.25; 37 2.75,4.25; 38 2.25,4.25; 39 1.75,4.25; 40 1.25,4.25; 41 0.75,4.25; 42 0.25,4.25; 43 -0.25,4.25; 44 -0.75,4.25; 45 -1.25,4.25; 46 -1.75,4.25; 47 -2.25,4.25; 48 -2.75,4.25
SOT95P237X112-3N = smd 0.559 x 1.27: 1 -0.94,-1.041; 2 0.94,-1.041; 3 0,1.041
AK500/2 = drill 1.321 long: 1 -2.515,0; 2 2.515,0
AK500/3 = drill 1.321 long: 1 -5.004,0; 2 0,0; 3 5.004,0
J1011F21PNL = drill 0.9 pad 1.3: 1 4.445,2.54; 2 3.175,0; 3 1.905,2.54; 4 0.635,0; 5 -0.635,2.54; 6 -1.905,0; 7 -3.175,2.54; 8 -4.445,0 | drill 1 pad 1.422: 9 5.465,7.37; 10 2.925,7.37; 11 -2.925,7.37; 12 -5.465,7.37 | drill 1.6 pad 2.184: M1 -7.875,-3.3; M2 7.875,-3.3 | hole 3.3: 5.715,-6.35; -5.715,-6.35
PN61729-S = drill 0.95 octagon: 1 1.25,4.71; 2 -1.25,4.71; 3 -1.25,2.71; 4 1.25,2.71 | drill 2.3 pad 2.9: S1 -6.02,0; S2 6.02,0
XBEE = drill 0.8 pad 1.27: 1 -11,9; 2 -11,7; 3 -11,5; 4 -11,3; 5 -11,1; 6 -11,-1; 7 -11,-3; 8 -11,-5; 9 -11,-7; 10 -11,-9; 11 11,-9; 12 11,-7; 13 11,-5; 14 11,-3; 15 11,-1; 16 11,1; 17 11,3; 18 11,5; 19 11,7; 20 11,9

### Placement (x,y rotation side)
25MHZ  55.88,38.1 0 top
C1  51.44,64.77 0 top
C2  92.08,8.89 270 top
C3  81.95,10.73 180 top
C4  43.18,31.11 90 top
C5  34.29,27.94 0 top
C6  32.64,11.43 270 top
C7  100.33,22.23 270 top
C8  97.16,31.75 90 top
C9  90.87,17.56 180 top
C10  86.84,40.51 180 top
C11  64.77,51.44 90 top
C12  68.9,51.44 90 top
C13  57.75,45.85 180 top
C14  74.93,40.64 0 top
C15  86.83,38.41 0 top
C16  57.75,43.78 180 top
C17  73.66,45.64 0 top
C18  62.71,51.44 270 top
C19  66.83,51.44 270 top
C20  53.34,43.81 90 top
C21  86.83,35.69 0 top
C22  81.19,33.15 0 top
C23  74.93,17.78 270 top
C24  69.85,13.97 270 top
C27  85.72,19.68 90 top
C28  80.64,13.97 270 top
C40  87,64.77 0 top
C41  42.55,64.77 0 top
C42  97.16,64.77 0 top
C43  78.11,64.77 0 top
C44  60.33,64.77 0 top
C45  33.66,64.77 0 top
C46  69.22,64.77 0 top
FL1  76.2,32.38 270 top
IC2  35.56,31.75 180 top
IC3  93.98,23.5 0 top
IC4  25.4,50.8 90 top
IC5  48.26,29.84 90 top
IC6  35.56,17.14 180 top
IC8  69.85,21.59 0 top
IC9  80.64,21.59 0 top
J2  100.42,8.81 270 top
R1  30.48,31.11 270 top
R2  69.85,7.62 270 top
R3  27.94,31.11 270 top
R4  53.09,20.32 270 top
R5  46.99,64.77 180 top
R6  67.31,7.62 90 top
R7  69.85,3.17 270 top
R8  72.39,3.17 90 top
R9  51.05,20.32 90 top
R10  72.39,7.62 90 top
R11  94.61,34.29 90 top
R13  28.57,18.48 180 top
R14  28.57,13.34 0 top
R15  46.99,20.32 90 top
R16  49.02,20.32 90 top
R17  55.12,20.32 90 top
R18  44.96,20.32 90 top
R19  28.57,15.88 0 top
R20  57.15,20.32 270 top
R21  42.93,20.32 90 top
R23  86.84,42.58 180 top
R24  81.19,45.12 180 top
R25  81.19,42.6 180 top
R26  81.19,35.66 180 top
R27  81.19,38.82 180 top
R28  86.86,33.54 180 top
R29  86.86,47.01 180 top
R30  56.29,32.38 270 top
R31  58.42,32.38 270 top
R32  60.52,32.38 270 top
R33  62.61,32.38 270 top
R34  64.71,32.35 270 top
R35  66.8,32.35 270 top
R36  68.9,32.35 270 top
R37  70.99,32.35 270 top
R38  73.12,32.32 270 top
R39  73.66,43.6 0 top
R40  60.64,51.44 270 top
R44  82.55,64.77 180 top
R45  38.1,64.77 180 top
R46  92.71,64.77 180 top
R47  73.66,64.77 180 top
R48  55.88,64.77 180 top
R49  29.21,64.77 180 top
R50  64.77,64.77 180 top
U1  66.04,42.55 180 top
U$2  64.77,18.41 270 top
U$4  6.99,68.71 0 top
X1  69.24,70.28 180 top
X2  15.75,3.6 0 top
X3  59.24,70.28 180 top
X4  81.73,70.28 180 top
X5  46.73,70.28 180 top
X6  45.85,3.6 0 top
X8  34.24,70.28 180 top
X9  99.69,52.07 90 top
X10  30.86,3.6 0 top
X11  80.64,3.6 0 top
X12  94.36,70.28 180 top
X13  106.68,31.11 90 top
XB1  12.7,25.91 180 top

### Tracks (layer width: path | path; a pad name or v marks a point on that pad's centre or on a via)
3.3V  (via drill 0.35)
  Top 0.254: U$2.2 64.9,18.64 64.9,18.81 66.67,20.59 v66.67,20.95 | FL1.2 76.14,31.38 76.14,31.37
  Top 0.305: IC3.4 91.7,17.67 C9.1 93.12,17.56 v93.34,17.78 | C20.1 53.66,42.55 57.78,42.55 58.7,43.46 C16.1 | C16.1 C13.1 | U1.28 58.72,43.8 C16.1 | R29.2 85.91,45.27 v85.72,45.09 | R28.2 85.92,31.3 v85.72,31.11 83.82,29.21 77.47,29.21 76.2,30.48 FL1.2
  Top 0.61: C24.1 69.88,14.95 IC8.2 69.88,20.3 69.22,20.95 v66.67,20.95 | v65.41,24.77 65.41,27.3 66.67,28.57 | 66.67,28.57 67.94,28.57 68.9,29.53 R36.2 R37.2 71.03,31.37 R38.2 76.14,31.37 | 66.67,28.57 57.15,28.57 56.52,29.21 56.52,31.21 R30.2 54.29,31.43 53.34,32.38 25MHZ.1 25MHZ.4 C20.1 | R3.2 R1.2 30.8,29.84 IC2.8 33.2,28.08 C5.1 33.34,26.98 v34.29,26.04 43.47,26.04 45.38,27.94 | IC5.P$20 45.38,30.14 | 45.38,30.14 45.09,29.84 43.5,29.84 C4.1 | IC5.P$1 45.38,27.94 | 45.38,27.94 45.38,30.14
  Bottom 0.305: v85.72,45.09 v85.72,31.11 90.81,31.11 93.34,28.57 v93.34,17.78
  Bottom 0.61: v66.67,20.95 65.41,22.23 v65.41,24.77 35.56,24.77 v34.29,26.04 34.29,22.86 26.04,14.61 26,14.61 XB1.1
+12V
  Top 0.61: R10.2 72.71,8.89 83.19,8.89
  Top 0.813: 82.96,10.67 83.19,10.44 | 85.43,18.44 C27.1
  Top 1.016: 82.96,10.67 IC9.3 85.43,18.44 | C3.1 83.19,10.44 83.19,8.89
  Bottom 1.016: X5.1 51.73,73.96 52.7,74.93 109.22,74.93 110.37,73.78 110.37,6.86
  pour Top (isolate 0.122, no thermals): 80.64,8.89 111.12,8.89 111.12,0 80.64,0
  pour Bottom (isolate 0.122, no thermals): 80.64,8.89 111.12,8.89 111.12,0 80.64,0
ACT_LED  (via drill 0.35)
  Top 0.254: U1.27 60.48,44.3 v60.33,44.45 | v82.55,49.53 91.94,49.53 X9.11
  Bottom 0.254: v60.33,44.45 60.33,45.72 64.14,49.53 v82.55,49.53
AT_PARK_PIN
  Top 0.254: IC5.P$11 51.23,35.13 49.53,36.83 IC4.20
AT_PARK_PIN-IN_EXT
  Top 1.016: R46.2 91.76,68.49 91.85,68.58 X12.2
AT_PARK_PIN_IN_5V  (via drill 0.35)
  Top 0.254: R20.1 57.15,21.59 55.24,23.5 53.34,23.5 50.58,26.26 IC5.P$9 50.58,27.71 v52.07,29.21 | R46.1 93.66,63.18 v93.34,62.87 | v53.34,50.16 53.34,46.61 v52.96,46.23
  Top 1.016: R46.1 C42.1
  Bottom 0.254: v93.34,62.87 87,56.52 59.05,56.52 53.34,50.8 v53.34,50.16 | v52.96,46.23 52.96,39.21 50.83,37.08 50.83,36.58 52.7,34.7 52.7,29.84 v52.07,29.21
AVDD
  Top 0.254: C11.1 64.79,50.47 U1.21 64.79,45.7 65.41,45.09 | C12.1 68.9,48.58 67.79,47.47 U1.15 67.79,45.24 67.94,45.09 | 68.58,45.09 68.87,44.8 U1.11 71.47,44.8 72.31,45.64 72.47,45.64 C17.1 72.71,46.67 73.03,46.99 79.38,46.99 | U1.8 68.69,43.3 68.58,43.18 | C14.1 73.03,40.64 72.37,41.3 U1.4 70.27,41.27 68.58,41.27 | U1.17 66.79,45.2 66.67,45.09 | R25.2 R24.2 80.24,46.12 79.38,46.99 | 79.38,46.99 83.82,46.99 84.45,46.35 84.45,44.01 R23.2
  Top 0.61: 65.41,45.09 66.67,45.09 67.94,45.09 68.58,45.09 68.58,43.18 68.58,41.27 68.58,40.01 70.48,38.1 73.66,38.1 76.2,35.56 FL1.1
BUTTON_EAST_OPEN
  Top 0.254: IC4.15 36.83,38.1 37.47,37.47 38.73,37.47 40.01,36.2 41.27,36.2 41.91,35.56 45.72,35.56 46.35,34.92 48.26,34.92 48.62,34.56 IC5.P$15
BUTTON_EAST_OPEN-IN_EXT
  Top 1.016: X4.2 81.73,64.9 R44.2
BUTTON_EAST_OPEN_5V  (via drill 0.35)
  Top 0.254: R16.2 49.02,24 47.98,25.05 IC5.P$5 47.98,27.81 48.2,28.04 48.2,28.52 48.26,28.57 | 48.26,28.57 v48.36,28.67 | R44.1 83.5,63.18 v83.19,62.87 | v52.7,51.44 52.7,48.26 52.35,47.9 52.35,46 v52.07,45.72 | v50.19,31.11 48.26,29.19 48.26,28.57
  Top 1.016: R44.1 C40.1
  Bottom 0.254: v83.19,62.87 77.24,56.92 58.89,56.92 53.4,51.44 v52.7,51.44 | v52.07,45.72 52.07,38.9 50.42,37.25 50.42,31.37 50.16,31.11 v50.19,31.11
BUTTON_WEST_CLOSE
  Top 0.254: IC4.14 34.29,38.1 34.92,37.47 36.83,37.47 37.47,36.83 38.73,36.83 40.01,35.56 41.27,35.56 41.91,34.92 45.72,34.92 46.35,34.29 47.62,34.29 47.98,33.94 IC5.P$16
BUTTON_WEST_CLOSE-IN_EXT
  Top 1.016: X4.3 72.71,66.26 R47.2
BUTTON_WEST_CLOSE_IN_5V  (via drill 0.35)
  Top 0.254: R15.2 46.99,23.5 47.33,23.83 IC5.P$4 47.33,27.7 47.4,27.77 47.4,28.19 47.5,28.29 v47.6,28.29 | R47.1 74.61,63.18 v74.3,62.87 | v52.07,52.7 52.07,48.92 50.52,47.37 50.52,46.61 50.8,46.33 v50.8,45.09 | v50.19,42.55 v48.26,42.55
  Top 1.016: R47.1 C43.1
  Bottom 0.254: v74.3,62.87 68.76,57.33 58.72,57.33 54.1,52.7 v52.07,52.7 | v47.6,28.29 47.6,29.16 48.54,30.1 48.54,30.86 48.26,31.14 v48.26,42.55 | v50.8,45.09 50.8,43.18 50.16,42.55 v50.19,42.55
DTR_DSR_DCD  (via drill 0.35)
  Top 0.254: IC3.2 90.41,21.19 90.81,21.59 v90.81,21.54 | v95.25,17.78 95.25,18.54 95.63,18.92 95.63,19.84 IC3.10 IC3.9
  Bottom 0.254: v90.81,21.54 92.74,19.61 92.74,17.53 93.09,17.17 93.6,17.17 94.2,17.78 v95.25,17.78
ETH_CS
  Top 0.254: U1.32 63.38,41.8 64.14,42.55 64.14,44.83 60.07,48.9 59.05,48.9 52.7,55.24 47.62,55.24 46.99,55.88 IC4.22
ETH_RESET  (via drill 0.35)
  Top 0.254: R30.1 56.29,34.7 v57.15,35.56 60.33,35.56 62.23,37.47 62.87,37.47 63.29,37.89 U1.37 | IC4.26 36.83,57.15 40.01,53.98 51.44,42.55 v51.44,36.83
  Bottom 0.254: v51.44,36.83 52.7,35.56 v57.15,35.56
FTDI_RESET  (via drill 0.35)
  Top 0.305: R11.1 v94.61,31.75
  Top 0.406: IC4.34 v16.51,62.23 | IC3.19 95.61,29.49 94.61,30.48 v94.61,31.75
  Bottom 0.406: v16.51,62.23 17.65,63.37 31.16,63.37 32.15,64.36 56.56,64.36 56.79,64.14 100.97,64.14 100.97,38.1 v94.61,31.75
GND  (via drill 0.3, 0.35, 0.5 pad 1.27)
  other vias: 31.11,13.34 36.83,8.26 38.73,8.26 36.83,10.16 64.77,20.32 66.04,17.14 50.16,22.86 48.26,22.86 46.35,22.86 43.81,22.86 51.69,22.86 67.31,48.26 71.37,43.43 66.04,42.55 67.31,43.81 67.31,40.64 63.5,43.18 63.5,40.64 77.47,44.45 71.75,36.2 47.62,30.48 40.01,27.94 90.17,29.21 74.93,24.13 60.96,26.67 49.53,12.7 53.98,12.7 57.78,12.7 81.92,31.11 83.82,40.64 19.05,55.88 31.75,55.88 44.45,55.88 44.45,43.81 31.75,43.81 19.05,43.81 6.35,55.88 6.35,43.81 51.44,46.99 71.75,40.64
  pour Bottom (isolate 0.122, rank 2, no thermals): 0,0 0,76.2 111.12,76.2 111.12,0
  pour Top (isolate 0.122, rank 2, no thermals): 0,0 0,76.2 111.12,76.2 111.12,0
HOME_SHUTTER_CLOSED
  Top 0.254: IC5.P$17 47.33,33.55 46.99,33.88 46.19,33.88 45.78,34.29 41.91,34.29 41.27,34.92 40.01,34.92 38.73,36.2 37.47,36.2 36.83,36.83 24.77,36.83 24.13,37.47 IC4.10
HOME_SHUTTER_CLOSED-IN_EXT
  Top 1.016: X1.2 63.82,67.38 R50.2
HOME_SHUTTER_CLOSED_IN_5V  (via drill 0.35)
  Top 0.254: R18.2 44.96,24 46.67,25.72 IC5.P$3 46.67,27.62 46.99,27.94 46.99,28.7 v46.99,29.21 | R50.1 65.72,63.18 v65.41,62.87 | v36.83,55.24 43.11,48.97 v43.18,49.02
  Top 1.016: R50.1 C46.1
  Bottom 0.254: v65.41,62.87 57.37,62.87 56.36,63.88 32.6,63.88 32.01,63.28 32.01,62.15 36.83,57.33 v36.83,55.24 | v43.18,49.02 43.18,42.55 43.18,33.02 v46.99,29.21
LINK_ACK  (via drill 0.35)
  Top 0.254: U1.25 61.38,45.3 v60.21,46.47
  Bottom 0.254: v60.21,46.47 63.91,50.16 83.82,50.16 88.65,54.99 X9.10
M_DIR
  Top 0.254: IC4.5 11.43,32.38 19.82,23.99 24.63,23.99 24.77,24.13 31.75,24.13 36.83,19.05 36.83,16.51 37.78,15.56 IC6.P$3
M_DIR_5V
  Top 0.305: R19.2 29.86,16.21 IC6.P$17 33.97,16.21 35.38,14.79 35.38,14.78 35.56,14.61 35.56,7.62 34.92,6.99 32.38,6.99 30.86,5.46 X10.2
M_EN
  Top 0.254: IC4.4 11.02,38.98 11.02,32.22 21.41,21.84 25.01,21.84 26.67,23.5 31.75,23.5 36.2,19.05 36.2,16.51 37.8,14.91 IC6.P$2
M_EN_5V
  Top 0.305: R14.2 29.52,13.65 31.43,15.56 IC6.P$18 33.97,15.56 34.92,14.61 34.92,8.89 33.48,7.44 32.2,7.44 31.74,6.99 18.41,6.99 15.75,4.32 X2.2
M_STEP
  Top 0.254: IC6.P$4 37.77,16.21 37.24,16.74 37.24,19.22 36.83,19.62 36.83,19.68 30.61,25.91 19.81,25.91 12.7,33.02 12.7,43.18 19.05,49.53 30.48,49.53 34.29,53.34 IC4.27
M_STEP_5V
  Top 0.305: R13.1 30.42,18.48 32.03,16.86 IC6.P$16 34.58,16.86 36.83,14.61 36.83,12.06 40.01,8.89 44.45,8.89 45.72,7.62 45.72,3.3 X6.2
N$2
  Top 0.61: R8.1 R7.2
N$3
  Top 0.61: R10.1 R8.2
N$5
  Top 0.61: R2.2 R7.1
N$6
  Top 0.305: C8.1 96.91,30.55 IC3.17
N$7
  Top 0.254: R27.2 80.24,37.47 | 80.24,37.47 R26.2 C22.1 | X9.6 98.42,48.9 98.42,46.35 89.42,37.35 85.11,37.35 84.99,37.47 80.24,37.47
N$8
  Top 0.305: X9.9 93.38,56.48 93.38,48.33 92.71,47.66 91.89,47.66 91.85,47.62 88.42,47.62 R29.1
N$9
  Top 0.254: XB1.12 1.7,32.58 2.87,31.41 2.87,26.18 2.87,26.08 XB1.16
N$10  (via drill 0.35)
  Top 0.305: R28.1 88.78,33.54 v92.08,36.83
  Bottom 0.305: v92.08,36.83 92.33,37.08 X9.12
N$11
  Top 0.305: C15.2 88.57,38.41 97.16,46.99 X9.7
N$12
  Top 0.305: C21.2 89.03,35.69 99.69,46.35 X9.8
N$13
  Top 0.305: R23.1 90.84,42.58 95.89,47.62 95.89,53.34 96.52,53.98 X9.3
  Top 0.406: R23.1 C10.1
N$22
  Top 0.254: R31.1 58.42,34.29 59.05,34.92 60.33,34.92 62.23,36.83 62.87,36.83 63.79,37.76 U1.38
N$23
  Top 0.254: R32.1 60.52,34.48 60.96,34.92 62.23,36.2 62.87,36.2 64.29,37.62 U1.39
N$24
  Top 0.254: R33.1 62.61,35.31 64.79,37.48 U1.40
N$25
  Top 0.254: R34.1 64.71,36.77 65.29,37.35 U1.41
N$26
  Top 0.254: R35.1 66.8,36.07 65.79,37.08 U1.42
N$27
  Top 0.254: R36.1 68.9,34.61 66.29,37.22 U1.43
N$28
  Top 0.254: R37.1 67.47,36.83 67.31,36.83 66.79,37.35 U1.44
N$29
  Top 0.254: R38.1 71.47,34.92 69.95,34.92 67.29,37.58 U1.45
N$31
  Top 0.254: U1.20 65.29,47.51 66.83,49.05 C19.2
N$33
  Top 0.254: U1.22 64.29,48.1 62.71,49.69 C18.2
N$34
  Top 0.254: U1.10 71.91,44.3 72.6,43.6 R39.1
N$35
  Top 0.254: U1.23 63.79,47.97 62.87,48.9 61.59,48.9 60.64,49.85 R40.2
RESET  (via drill 0.35)
  Top 0.406: IC4.30 v26.67,56.52 | v61.59,19.05 63.42,19.05 U$2.1
  Bottom 0.406: v26.67,56.52 26.67,48.9 20.32,42.55 20.32,15.88 22.86,13.34 30.15,13.34 31.34,14.53 57.07,14.53 v61.59,19.05
RG-11
  Top 0.254: IC4.17 41.91,37.47 42.55,36.83 45.72,36.83 46.35,36.2 48.9,36.2 49.92,35.16 IC5.P$13
RG-11-IN_5V  (via drill 0.35)
  Top 0.254: R4.1 53.09,22.48 49.27,26.29 IC5.P$7 49.27,27.94 v50.67,29.34 | R5.1 47.94,63.18 v47.62,62.87 | v48.26,53.34 v48.26,50.16
  Top 1.016: R5.1 C1.1
  Bottom 0.254: v47.62,62.87 47.62,53.98 v48.26,53.34 | v48.26,50.16 48.26,47.62 49.58,46.3 49.58,30.43 v50.67,29.34
RG-11-IN_EXT
  Top 1.016: X5.2 46.04,69.59 R5.2
RTS_CTS
  Top 0.305: IC3.3 91.2,20.02 91.2,20.75 91.44,20.99 91.44,21.8 91.86,22.23 95.76,22.23 96.27,21.72 96.27,19.88 IC3.11
RX2  (via drill 0.35)
  Top 0.254: IC4.12 v29.21,43.18 | v29.84,27.3 31.75,27.3 v35.56,23.5 | v89.53,21.46 89.75,21.24 IC3.1
  Bottom 0.254: v29.21,43.18 29.21,27.94 v29.84,27.3 | v35.56,23.5 63.28,23.5 66.42,20.35 66.93,20.35 68.04,21.46 v89.53,21.46
RXN  (via drill 0.35)
  Top 0.254: C21.1 85.86,35.66 R26.1 | U1.5 72.28,41.8 v72.39,41.91
  Top 0.305: R26.1 82.14,35.97 v81.28,36.83
  Bottom 0.254: v81.28,36.83 81.28,39.15 78.52,41.91 v72.39,41.91
RXP  (via drill 0.35)
  Top 0.254: R27.1 82.55,38.82 | 82.55,38.82 85.47,38.82 C15.1 | U1.6 71.5,42.3 v71.72,42.51 | v71.72,42.51 71.75,42.55 v71.72,42.51 | v81.27,40.02 81.31,40.06 82.55,38.82
  Bottom 0.254: v71.72,42.51 78.77,42.51 v81.27,40.02 | v81.27,40.02 81.28,40.01 v81.27,40.02
SCL
  Top 0.254: R1.1 30.8,32.38 IC2.6 34.29,32.38 34.92,33.02 34.92,34.29 34.29,34.92 27.94,34.92 26.92,33.91 20.07,33.91 16.51,37.47 IC4.7
SCLK  (via drill 0.35)
  Top 0.254: IC4.24 41.91,55.24 42.55,54.61 52.07,54.61 58.42,48.26 60.13,48.26 63.5,44.89 v63.5,44.45 | v64.14,41.27 61.81,41.27 U1.33
  Bottom 0.254: v64.14,41.27 64.77,41.91 64.77,43.18 v63.5,44.45
SDA
  Top 0.254: IC2.5 28.57,33.66 27.94,33.02 R3.1 27.75,31.88 20.19,31.88 13.97,38.1 IC4.6
SDI  (via drill 0.35)
  Top 0.254: U1.34 60.8,40.8 v60.33,41.27 | IC4.21 v49.53,57.78
  Bottom 0.254: v49.53,57.78 49.53,52.07 v60.33,41.27
SDO  (via drill 0.35)
  Top 0.254: U1.35 60.62,40.3 v60.33,40.01 | IC4.25 v39.37,58.42
  Bottom 0.254: v39.37,58.42 39.37,56.52 41.91,53.98 46.35,53.98 v60.33,40.01
SHUTTER_OPENED
  Top 0.254: IC4.19 46.99,37.47 47.62,36.83 48.9,36.83 50.58,35.15 IC5.P$12
SHUTTER_OPENED-IN_EXT
  Top 1.016: X3.2 54.93,68.48 R48.2
SHUTTER_OPENED_IN_5V  (via drill 0.35)
  Top 0.254: R17.2 55.12,22.35 54.61,22.86 53.34,22.86 49.92,26.27 IC5.P$8 49.92,27.7 51.44,29.21 v51.44,29.84 51.44,32.05 52.04,32.65 52.04,42.51 49.89,44.67 49.89,52.43 v50.8,53.34 | R48.1 56.83,63.18 v56.52,62.87
  Top 1.016: R48.1 C44.1
  Bottom 0.254: v56.52,62.87 56.52,59.05 v50.8,53.34
SPARE1
  Top 0.254: IC4.9 21.59,37.47 22.23,36.83 22.86,36.83 23.5,36.2 36.83,36.2 37.47,35.56 38.73,35.56 40.01,34.29 41.27,34.29 41.91,33.66 45.84,33.66 46.02,33.48 46.35,33.48 46.67,33.16 IC5.P$18
SPARE1-IN_EXT
  Top 1.016: X8.1 37.15,69.89 R45.2
SPARE1_IN_5V  (via drill 0.35)
  Top 0.254: R21.2 42.93,23.24 46.02,26.34 IC5.P$2 46.02,28.25 v46.35,28.57 | R45.1 39.05,63.18 v38.73,62.87
  Top 1.016: R45.1 C41.1
  Bottom 0.254: v38.73,62.87 33.88,62.87 33.27,63.47 32.77,63.47 32.41,63.12 32.41,62.32 38.36,56.38 38.36,36.57 v46.35,28.57
SPARE2
  Top 0.254: IC4.16 39.37,37.47 40.01,36.83 41.27,36.83 41.91,36.2 45.72,36.2 46.35,35.56 48.26,35.56 49.27,34.55 IC5.P$14
SPARE2-IN_EXT
  Top 1.016: R49.2 28.26,66.81 X8.2
SPARE2_IN_5V  (via drill 0.35)
  Top 0.254: R9.2 51.05,23.24 48.62,25.67 IC5.P$6 48.62,28.08 48.97,28.42 48.97,28.77 49.15,28.96 v49.17,28.96 | C45.1 33.02,64.45 v33.02,62.87
  Top 1.016: R49.1 C45.1
  Bottom 0.254: v33.02,62.87 38.76,57.12 38.76,56.55 49.17,46.14 49.17,29.47 49.17,29.46 v49.17,28.96
TX2  (via drill 0.35)
  Top 0.254: IC4.11 v26.67,43.18 | v92.08,21.54 92.36,21.26 IC3.5
  Bottom 0.254: v26.67,43.18 26.67,27.94 27.97,26.64 59.7,26.64 60.58,25.76 61.34,25.76 61.62,26.04 87.63,26.04 90.81,22.86 90.81,22.81 v92.08,21.54
TXN  (via drill 0.35)
  Top 0.254: R25.1 82.06,42.6 81.62,42.16 81.62,41.61 80.65,40.64 79.12,40.64 77.68,39.2 71.28,39.2 70.69,39.8 U1.1
  Top 0.305: R25.1 83.24,42.6 v83.82,43.18
  Bottom 0.305: v83.82,43.18 84.45,43.81 84.45,48.26 85.09,48.9 88.9,52.7 94.35,52.7 96.89,55.24 X9.2
TXP  (via drill 0.35)
  Top 0.254: U1.2 71.08,40.3 71.77,39.61 77.41,39.61 79.08,41.27 80.71,41.27 81.21,41.77 81.21,44.19 R24.1
  Top 0.305: R24.1 83.22,45.12 v83.82,45.72
  Bottom 0.305: v83.82,45.72 83.82,48.9 84.45,49.53 88.4,53.47 94.11,53.47 X9.1
USBD_N
  Top 0.305: X13.2 101.29,29.18 98.85,29.18 97.56,27.89 IC3.16
USBD_P
  Top 0.305: X13.3 102.83,28.73 99.26,28.73 98.2,27.67 IC3.15
VCC  (via drill 0.35, 0.5 pad 1.27)
  Top 0.305: IC6.P$1 38.5,12.62 v38.58,12.54 | R13.2 R19.1 R14.1 27.62,11.74 27.94,11.43 30.48,11.43 31.43,12.38 C6.1
  Top 0.406: 80.64,20.32 83.19,22.86 100.02,22.86 C7.1 98.74,24.77 96.51,24.77 94.95,26.32 IC3.20
  Top 0.61: IC9.2 80.64,18.47 | 74.93,19.05 C23.1 | 41.02,12.45 40.95,12.38 | 38.73,12.38 v38.58,12.54 | C6.1 33.98,12.38 v34.29,12.06
  Top 0.813: IC9.2 80.67,14.95 C28.1
  Top 1.27: C23.1 74.64,18.44 IC8.3 72.16,19.91 69.85,22.23 62.23,22.23 59.38,19.37 R20.2 R17.1 R4.2 R9.1 R16.1 R15.1 R18.1 R21.1 42.93,14.35 41.02,12.45 | 80.64,18.47 80.64,20.32 80.01,20.95 76.83,20.95 74.93,19.05 | 40.95,12.38 38.73,12.38 | IC4.39 v3.81,55.88
  Bottom 0.61: v38.58,12.54 38.1,12.06 v34.29,12.06 34.29,6.99
  Bottom 1.27: v3.81,55.88 3.81,14.61 7.62,10.79 16.51,10.79 20.75,6.55 | 20.75,6.55 X2.3 | X10.3 35.87,5.41 34.29,6.99 | 34.29,6.99 21.18,6.99 20.75,6.55 | X6.3 50.85,5.03 48.9,6.99 34.29,6.99
  pour Top (isolate 0.122, no thermals): 31.88,14.22 33.53,14.22 33.53,11.75 31.88,11.75
VPIN  (via drill 0.35)
  Top 0.406: R6.2 67.31,9.53 v66.67,10.16 | v24.13,55.88 IC4.31
  Top 0.61: R6.2 R2.1
  Bottom 0.406: v66.67,10.16 45.72,10.16 41.91,13.97 33.66,13.97 30.48,10.79 21.59,10.79 17.78,14.61 17.78,45.72 24.13,52.07 v24.13,55.88
XBEE_DIN
  Top 0.254: IC4.1 3.4,38.98 3.4,20.15 5.78,17.78 23.28,17.78 23.32,17.82 24.17,17.82 24.77,18.41 24.77,19.84 XB1.3
XBEE_DOUT
  Top 0.254: IC4.2 3.81,20.32 5.22,18.91 XB1.2
XBEE_RESET  (via drill 0.35)
  Top 0.254: IC4.29 v29.21,62.23
  Bottom 0.254: v29.21,62.23 29.21,48.26 22.86,41.91 22.86,39.37 22.23,38.73 22.23,26.29 23.61,24.91 XB1.5
XI
  Top 0.254: U1.30 60.58,42.8 25MHZ.3

### Text on the board
tPlace: SPARE1 | SPARE2 | GND | RG-11 | 12V | Opened | GND | Home | GND | West | East | GND | AT_PARK_PIN_EXT | GND | GND | GND | EN | +5V | GND | DIR | +5V | GND | STEP | +5V | +12V
bPlace: SPARE1 | SPARE2 | GND | RG-11 | 12V | Opened | GND | Home | GND | West | East | GND | AT_PARK_PIN_EXT | GND | EN | +5V | DIR | +5V | STEP | +5V
tDocu: Dome Rotator / RoR